# EAGLE schematic CN-Cape006-via08-fixed (EAGLE 7.2.0)

## Sheet 1 of 7: Spannungsversorgung Verpolungsschutz ? Größe der Sicherung ? 1A oder 3A für Servos?
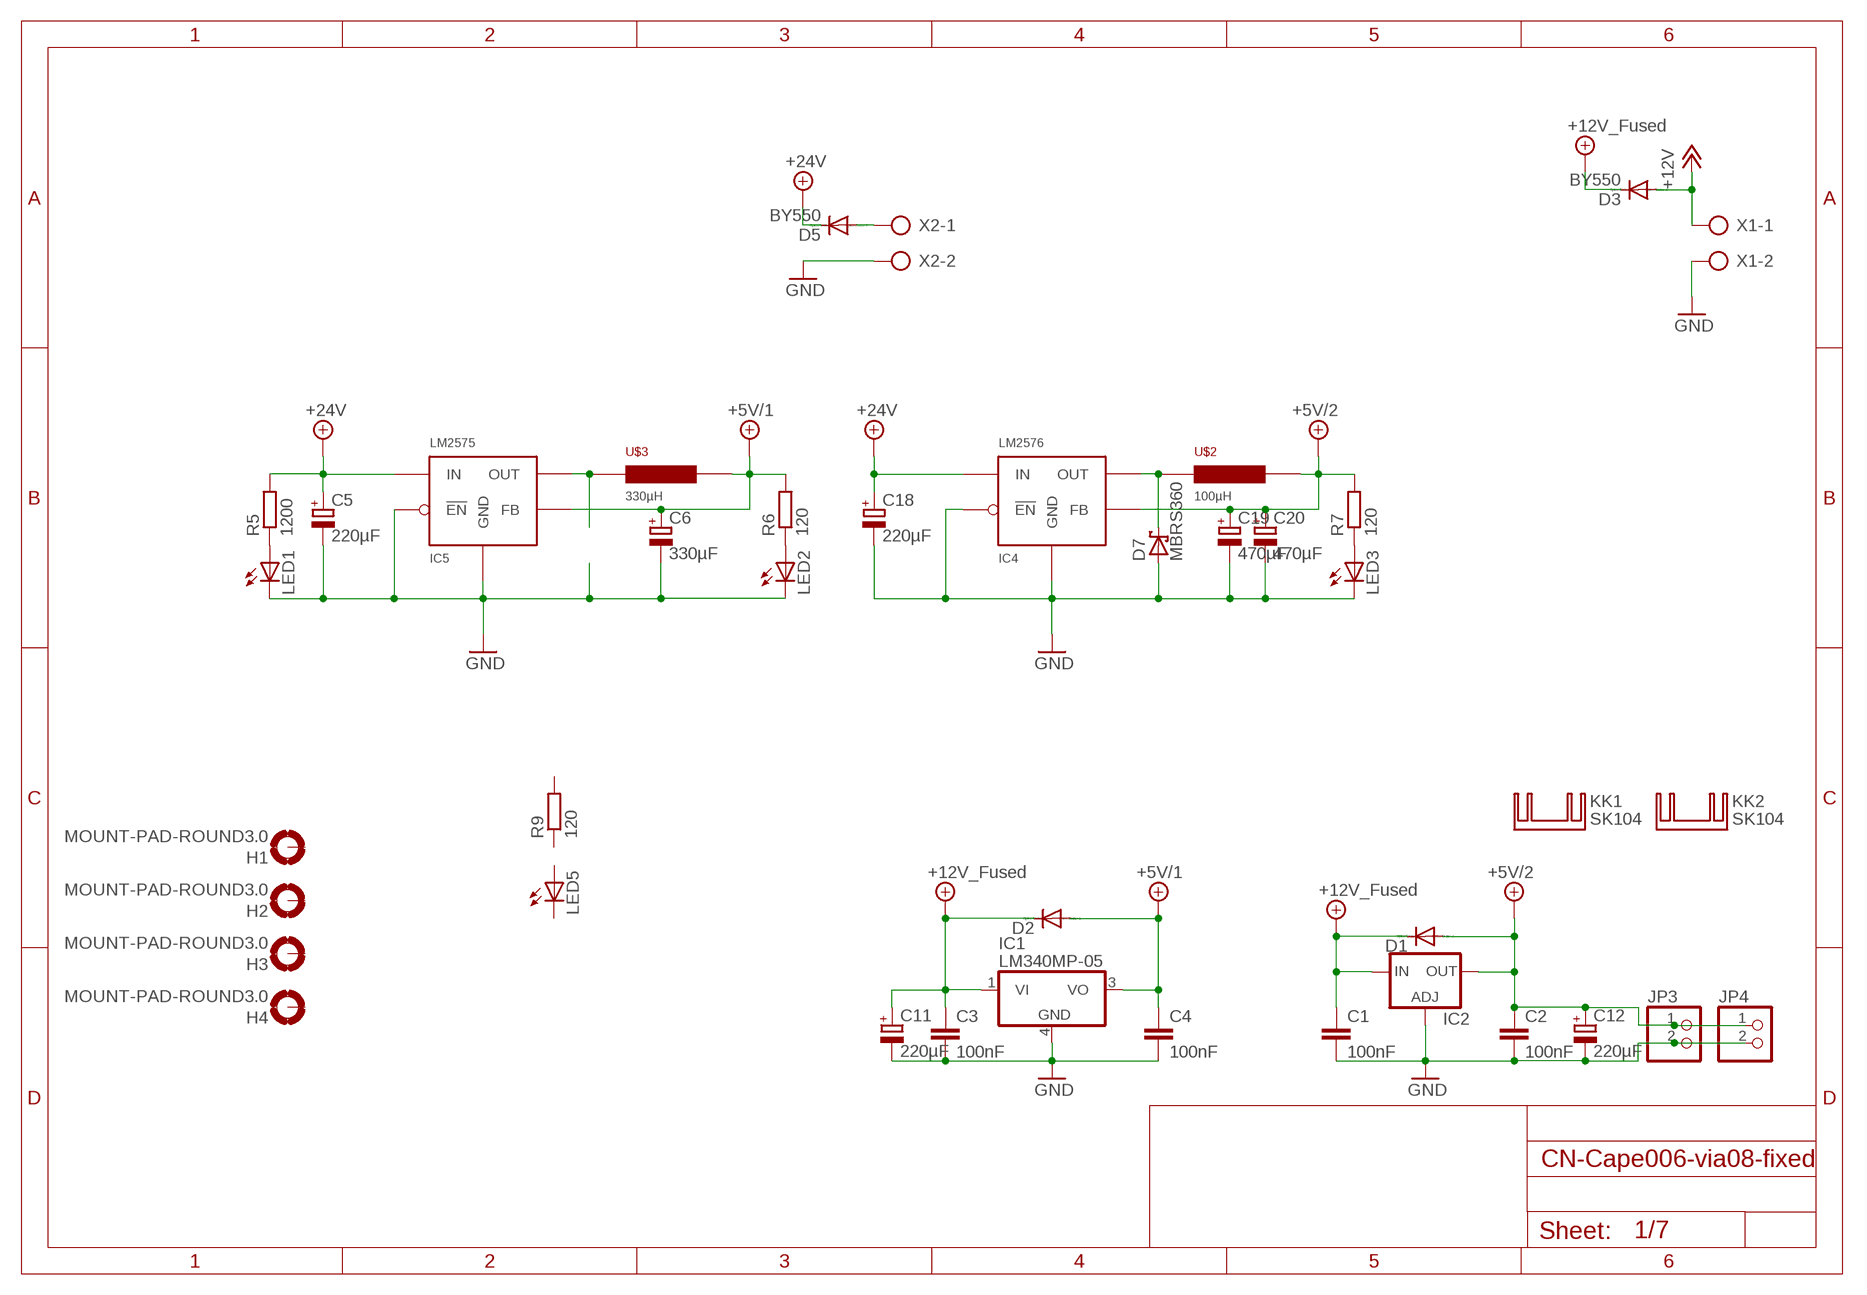
[diagram p0: schematic, sheet 1]

### Parts
C1  100nF  C-EUC0603  [C0603]
C2  100nF  C-EUC0603  [C0603]
C3  100nF  C-EUC0603  [C0603]
C4  100nF  C-EUC0603  [C0603]
C5  220µF  CPOL-EUE3.5-8  [E3,5-8]
C6  330µF  CPOL-EUE5-10.5  [E5-10,5]
C11  220µF  CPOL-EUE3.5-8  [E3,5-8]
C12  220µF  CPOL-EUE3.5-8  [E3,5-8]
C18  220µF  CPOL-EUE3.5-8  [E3,5-8]
C19  470µF  CPOL-EUE3.5-8  [E3,5-8]
C20  470µF  CPOL-EUE3.5-8  [E3,5-8]
D1  DIODE-SOD123  [SOD123]
D2  DIODE-SOD123  [SOD123]
D3  BY550  [DO27-15]
D5  BY550  [DO27-15]
D7  MBRS360  MBRS340T3  [SMC]
H1  MOUNT-PAD-ROUND3.0  [3,0-PAD]
H2  MOUNT-PAD-ROUND3.0  [3,0-PAD]
H3  MOUNT-PAD-ROUND3.0  [3,0-PAD]
H4  MOUNT-PAD-ROUND3.0  [3,0-PAD]
IC1  LM340MP-05  [SOT223]
IC2  LM138-TL  [TO220L1]
IC4  LM2576  LM2576-T05A  [TO-220-5_IN-LINE]
IC5  LM2575  LM2576-T05A  [TO-220-5_IN-LINE]
JP3  PINHD-1X2  [1X02]
JP4  PINHD-1X2  [1X02]
KK1  SK104  [SK104]
KK2  SK104  [SK104]
LED1  LEDCHIP-LED0603  [CHIP-LED0603]
LED2  LEDCHIP-LED0603  [CHIP-LED0603]
LED3  LEDCHIP-LED0603  [CHIP-LED0603]
LED5  LEDCHIP-LED0603  [CHIP-LED0603]
R5  1200  R-EU_R0805  [R0805]
R6  120  R-EU_R0805  [R0805]
R7  120  R-EU_R0805  [R0805]
R9  120  R-EU_R0805  [R0805]
U$2  100µH  PISR  [PISR]
U$3  330µH  PISR  [PISR]
X1  AK500/2-H  [AK500/2-H]
X2  AK500/2-H  [AK500/2-H]

### Nets
+5V/1: C4.1 C6.+ D2.A IC1.3(VO) IC5.FB R6.2 U$3.P$2 ; also sheet 2,3,4,5
+5V/2: C2.1 C12.+ C19.+ C20.+ D1.A IC2.2(OUT) IC4.FB JP3.1 JP4.1 R7.2 U$2.P$2 ; also sheet 5
+10V: C1.1 C3.1 C11.+ D1.C D2.C D3.C IC1.1(VI) IC2.3(IN) ; supply symbol labelled +12V_Fused
+12V: D3.A X1.1
+24V: C5.+ C18.+ D5.C IC4.IN IC5.IN R5.2
GND: C1.2 C2.2 C3.2 C4.2 C5.- C6.- C11.- C12.- C18.- C19.- C20.- D7.A IC1.4(GND) IC2.1(ADJ) IC4.!EN IC4.GND IC5.!EN IC5.GND JP3.2 JP4.2 LED1.C LED2.C LED3.C X1.2 X2.2 ; also sheet 2,3,4,5,6,7
N$5: D5.A X2.1
N$6: LED1.A R5.1
N$7: LED2.A R6.1
N$8: LED3.A R7.1
N$11: IC5.OUT U$3.P$1
N$12: D7.C IC4.OUT U$2.P$1
Unconnected: H1.B3,0(MOUNT) H2.B3,0(MOUNT) H3.B3,0(MOUNT) H4.B3,0(MOUNT) LED5.A LED5.C R9.1 R9.2

## Sheet 2 of 7: BeagleBoard Black Expansion Header
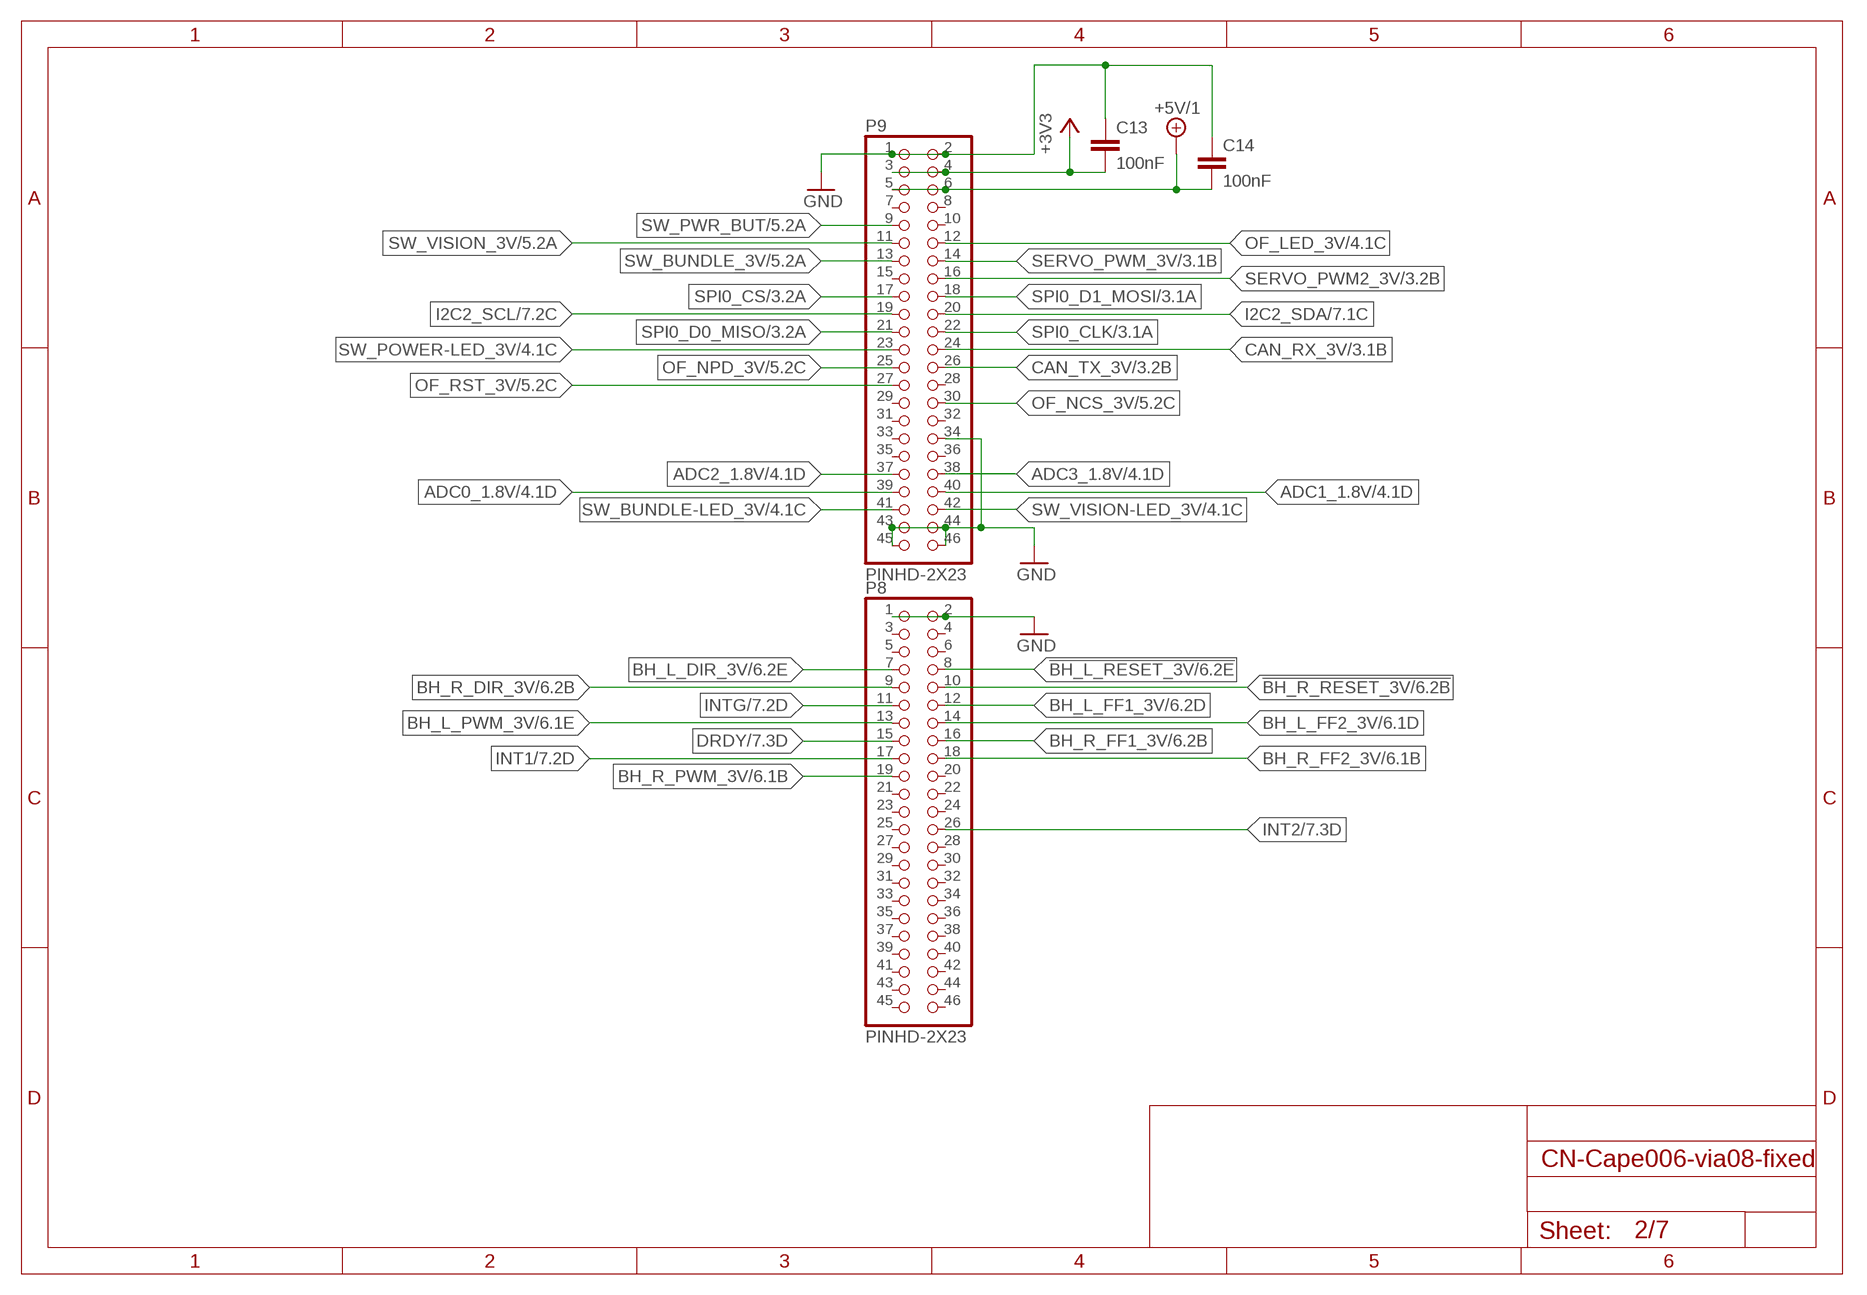
[diagram p1: schematic, sheet 2]

### Parts
C13  100nF  C-EUC0603  [C0603]
C14  100nF  C-EUC0603  [C0603]
P8  PINHD-2X23  [2X23]
P9  PINHD-2X23  [2X23]

### Nets
!BH_L_RESET_3V: P8.8 ; also sheet 6
!BH_R_RESET_3V: P8.10 ; also sheet 6
+3V3: C13.2 P9.3 P9.4 ; also sheet 3,6,7
+5V/1: C14.2 P9.5 P9.6 ; also sheet 1,3,4,5
ADC0_1.8V: P9.39 ; also sheet 4
ADC1_1.8V: P9.40 ; also sheet 4
ADC2_1.8V: P9.37 ; also sheet 4
ADC3_1.8V: P9.38 ; also sheet 4
BH_L_DIR_3V: P8.7 ; also sheet 6
BH_L_FF1_3V: P8.12 ; also sheet 6
BH_L_FF2_3V: P8.14 ; also sheet 6
BH_L_PWM_3V: P8.13 ; also sheet 6
BH_R_DIR_3V: P8.9 ; also sheet 6
BH_R_FF1_3V: P8.16 ; also sheet 6
BH_R_FF2_3V: P8.18 ; also sheet 6
BH_R_PWM_3V: P8.19 ; also sheet 6
CAN_RX_3V: P9.24 ; also sheet 3
CAN_TX_3V: P9.26 ; also sheet 3
DRDY: P8.15 ; also sheet 7
GND: C13.1 C14.1 P8.1 P8.2 P9.1 P9.2 P9.34 P9.43 P9.44 P9.45 P9.46 ; also sheet 1,3,4,5,6,7
I2C2_SCL: P9.19 ; also sheet 7
I2C2_SDA: P9.20 ; also sheet 7
INT1: P8.17 ; also sheet 7
INT2: P8.26 ; also sheet 7
INTG: P8.11 ; also sheet 7
OF_LED_3V: P9.12 ; also sheet 4
OF_NCS_3V: P9.30 ; also sheet 5
OF_NPD_3V: P9.25 ; also sheet 5
OF_RST_3V: P9.27 ; also sheet 5
SERVO_PWM2_3V: P9.16 ; also sheet 3
SERVO_PWM_3V: P9.14 ; also sheet 3
SPI0_CLK: P9.22 ; also sheet 3,5
SPI0_CS: P9.17 ; also sheet 3
SPI0_D0_MISO: P9.21 ; also sheet 3,5
SPI0_D1_MOSI: P9.18 ; also sheet 3,5
SW_BUNDLE-LED_3V: P9.41 ; also sheet 4
SW_BUNDLE_3V: P9.13 ; also sheet 5
SW_POWER-LED_3V: P9.23 ; also sheet 4
SW_PWR_BUT: P9.9 ; also sheet 5
SW_VISION-LED_3V: P9.42 ; also sheet 4
SW_VISION_3V: P9.11 ; also sheet 5
Unconnected: P8.3 P8.4 P8.5 P8.6 P8.20 P8.21 P8.22 P8.23 P8.24 P8.25 P8.27 P8.28 P8.29 P8.30 P8.31 P8.32 P8.33 P8.34 P8.35 P8.36 P8.37 P8.38 P8.39 P8.40 P8.41 P8.42 P8.43 P8.44 P8.45 P8.46 P9.7 P9.8 P9.10 P9.15 P9.28 P9.29 P9.31 P9.32 P9.33 P9.35 P9.36

## Sheet 3 of 7: Level Shifter
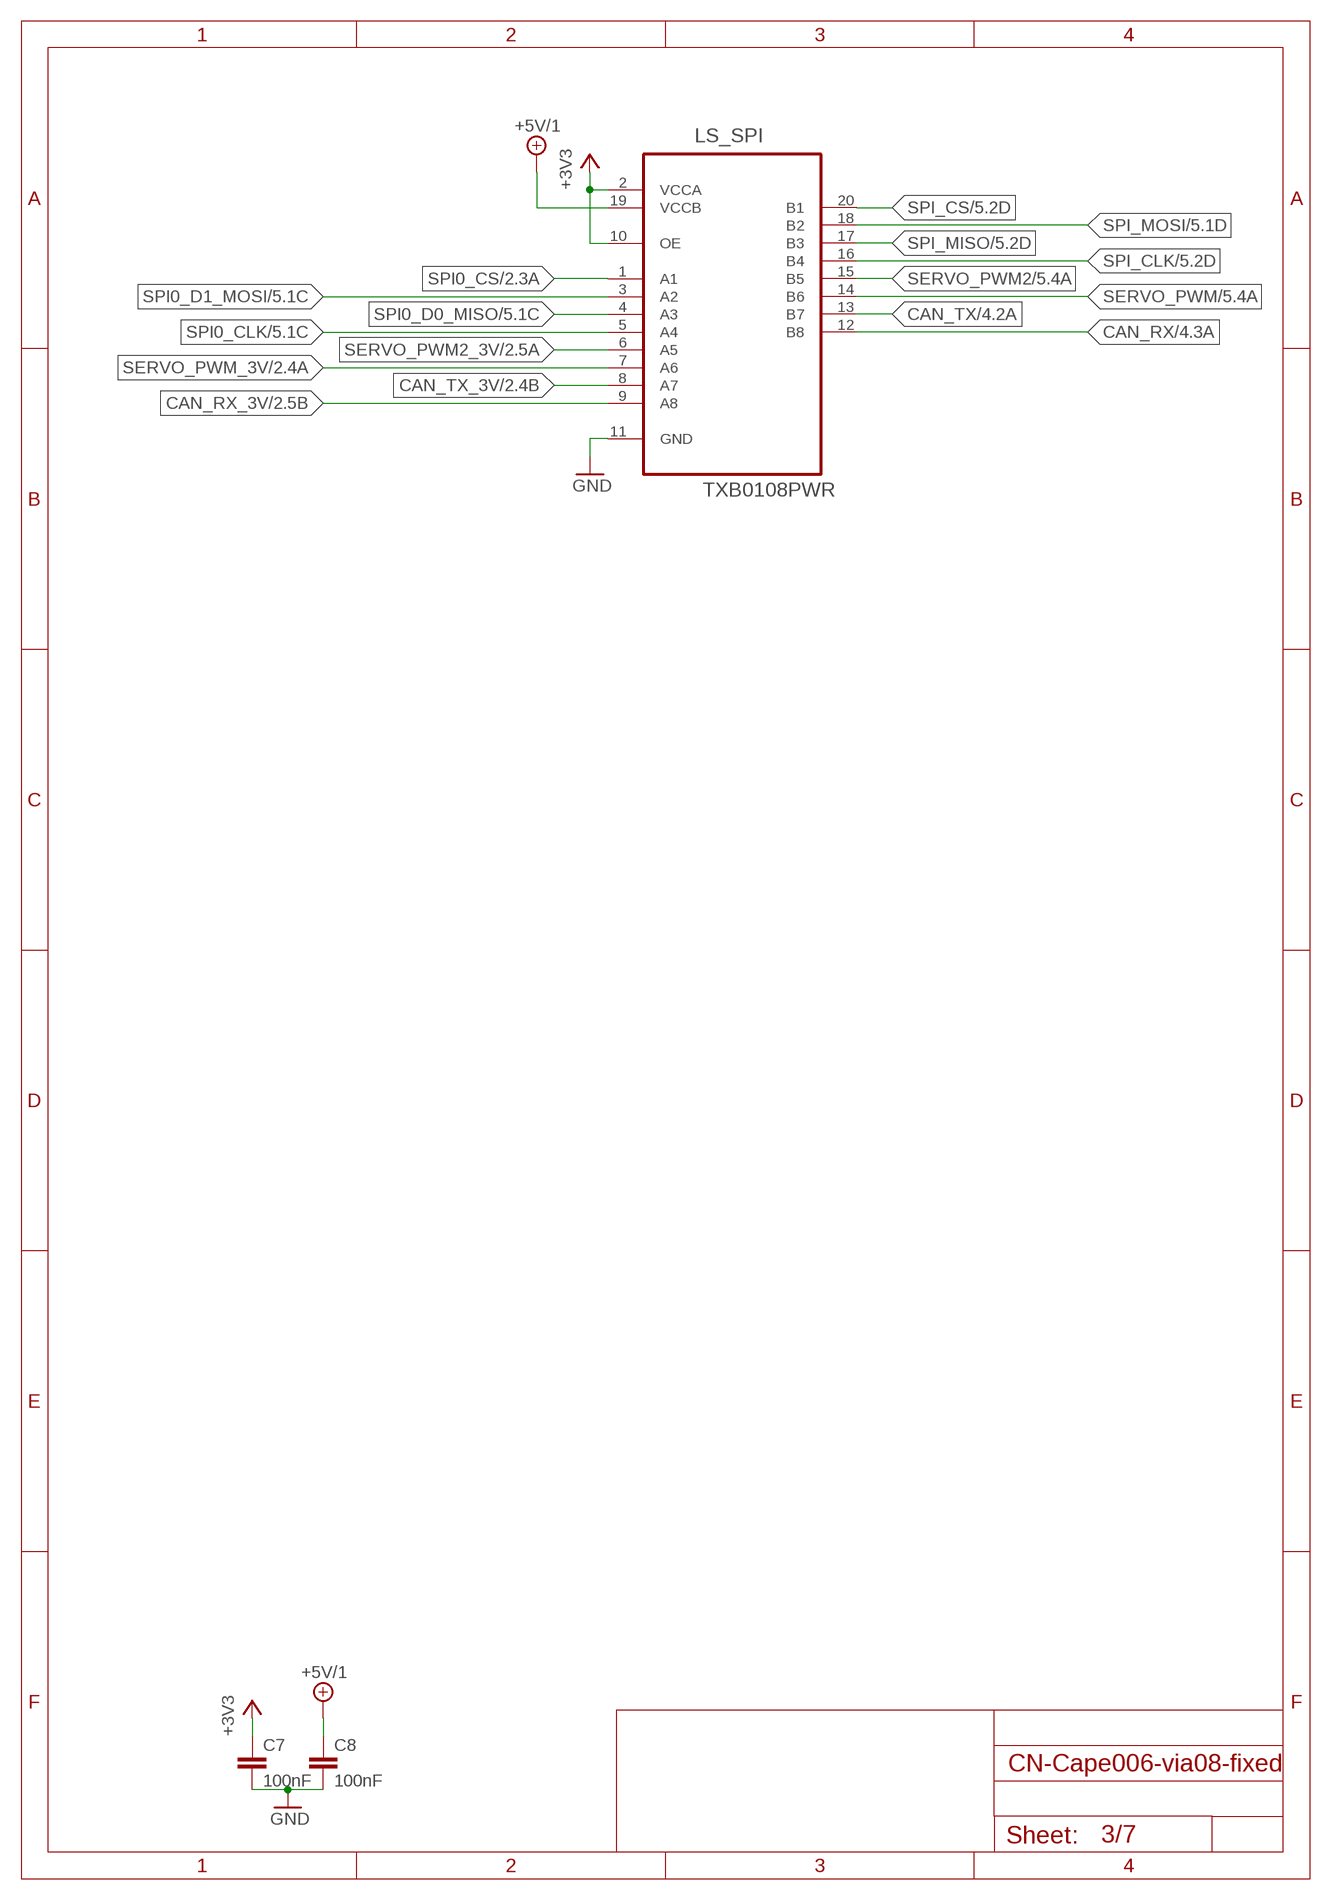
[diagram p2: schematic, sheet 3]

### Parts
C7  100nF  C-EUC0603  [C0603]
C8  100nF  C-EUC0603  [C0603]
LS_SPI  TXB0108PWR  [SOP65P640X120-20N]

### Nets
+3V3: C7.1 LS_SPI.2(VCCA) LS_SPI.10(OE) ; also sheet 2,6,7
+5V/1: C8.1 LS_SPI.19(VCCB) ; also sheet 1,2,4,5
CAN_RX: LS_SPI.12(B8) ; also sheet 4
CAN_RX_3V: LS_SPI.9(A8) ; also sheet 2
CAN_TX: LS_SPI.13(B7) ; also sheet 4
CAN_TX_3V: LS_SPI.8(A7) ; also sheet 2
GND: C7.2 C8.2 LS_SPI.11(GND) ; also sheet 1,2,4,5,6,7
SERVO_PWM: LS_SPI.14(B6) ; also sheet 5
SERVO_PWM2: LS_SPI.15(B5) ; also sheet 5
SERVO_PWM2_3V: LS_SPI.6(A5) ; also sheet 2
SERVO_PWM_3V: LS_SPI.7(A6) ; also sheet 2
SPI0_CLK: LS_SPI.5(A4) ; also sheet 2,5
SPI0_CS: LS_SPI.1(A1) ; also sheet 2
SPI0_D0_MISO: LS_SPI.4(A3) ; also sheet 2,5
SPI0_D1_MOSI: LS_SPI.3(A2) ; also sheet 2,5
SPI_CLK: LS_SPI.16(B4) ; also sheet 5
SPI_CS: LS_SPI.20(B1) ; also sheet 5
SPI_MISO: LS_SPI.17(B3) ; also sheet 5
SPI_MOSI: LS_SPI.18(B2) ; also sheet 5

## Sheet 4 of 7: CAN- Bus & LED Transistoren
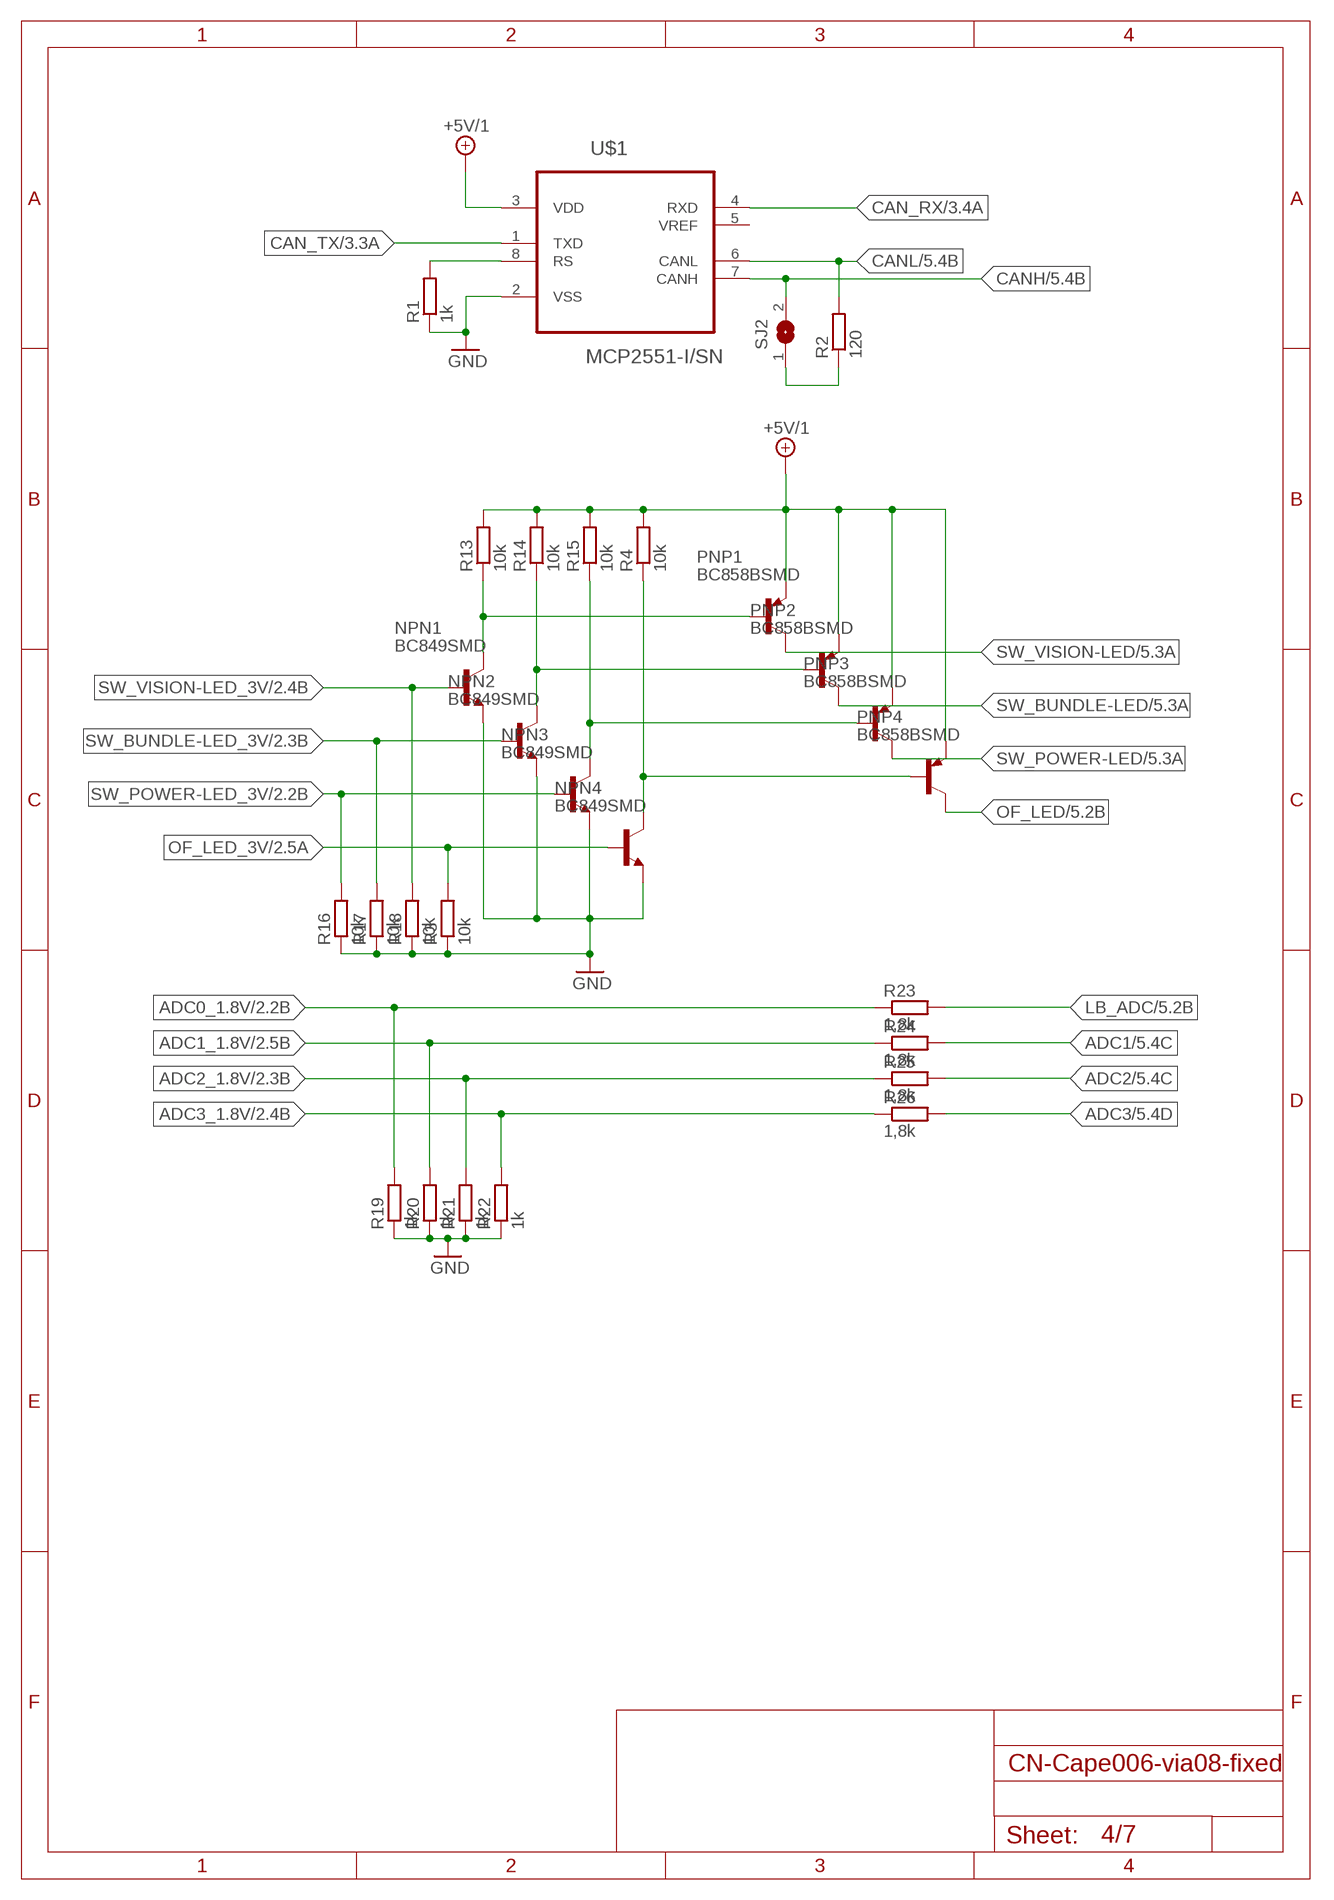
[diagram p3: schematic, sheet 4]

### Parts
NPN1  BC849SMD  [SOT23-BEC]
NPN2  BC849SMD  [SOT23-BEC]
NPN3  BC849SMD  [SOT23-BEC]
NPN4  BC849SMD  [SOT23-BEC]
PNP1  BC858BSMD  [SOT23-BEC]
PNP2  BC858BSMD  [SOT23-BEC]
PNP3  BC858BSMD  [SOT23-BEC]
PNP4  BC858BSMD  [SOT23-BEC]
R1  1k  R-EU_R0805  [R0805]
R2  120  R-EU_R0805  [R0805]
R3  10k  R-EU_R0805  [R0805]
R4  10k  R-EU_R0805  [R0805]
R13  10k  R-EU_R0805  [R0805]
R14  10k  R-EU_R0805  [R0805]
R15  10k  R-EU_R0805  [R0805]
R16  10k  R-EU_R0805  [R0805]
R17  10k  R-EU_R0805  [R0805]
R18  10k  R-EU_R0805  [R0805]
R19  1k  R-EU_R0805  [R0805]
R20  1k  R-EU_R0805  [R0805]
R21  1k  R-EU_R0805  [R0805]
R22  1k  R-EU_R0805  [R0805]
R23  1,8k  R-EU_R0805  [R0805]
R24  1,8k  R-EU_R0805  [R0805]
R25  1,8k  R-EU_R0805  [R0805]
R26  1,8k  R-EU_R0805  [R0805]
SJ2  SJ  [SJ]
U$1  MCP2551-I/SN  [SOIC127P600X175-8N]

### Nets
+5V/1: PNP1.E PNP2.E PNP3.E PNP4.E R4.2 R13.2 R14.2 R15.2 U$1.3(VDD) ; also sheet 1,2,3,5
ADC0_1.8V: R19.2 R23.1 ; also sheet 2
ADC1: R24.2 ; also sheet 5
ADC1_1.8V: R20.2 R24.1 ; also sheet 2
ADC2: R25.2 ; also sheet 5
ADC2_1.8V: R21.2 R25.1 ; also sheet 2
ADC3: R26.2 ; also sheet 5
ADC3_1.8V: R22.2 R26.1 ; also sheet 2
CAN_RX: U$1.4(RXD) ; also sheet 3
CAN_TX: U$1.1(TXD) ; also sheet 3
CANH: SJ2.2 U$1.7(CANH) ; also sheet 5
CANL: R2.2 U$1.6(CANL) ; also sheet 5
GND: NPN1.E NPN2.E NPN3.E NPN4.E R1.1 R3.1 R16.1 R17.1 R18.1 R19.1 R20.1 R21.1 R22.1 U$1.2(VSS) ; also sheet 1,2,3,5,6,7
LB_ADC: R23.2 ; also sheet 5
N$1: NPN1.C PNP1.B R13.1
N$2: NPN2.C PNP2.B R14.1
N$3: NPN4.C PNP4.B R4.1
N$4: NPN3.C PNP3.B R15.1
N$9: R1.2 U$1.8(RS)
N$10: R2.1 SJ2.1
OF_LED: PNP4.C ; also sheet 5
OF_LED_3V: NPN4.B R3.2 ; also sheet 2
SW_BUNDLE-LED: PNP2.C ; also sheet 5
SW_BUNDLE-LED_3V: NPN2.B R17.2 ; also sheet 2
SW_POWER-LED: PNP3.C ; also sheet 5
SW_POWER-LED_3V: NPN3.B R16.2 ; also sheet 2
SW_VISION-LED: PNP1.C ; also sheet 5
SW_VISION-LED_3V: NPN1.B R18.2 ; also sheet 2
Unconnected: U$1.5(VREF)

## Sheet 5 of 7: Connector
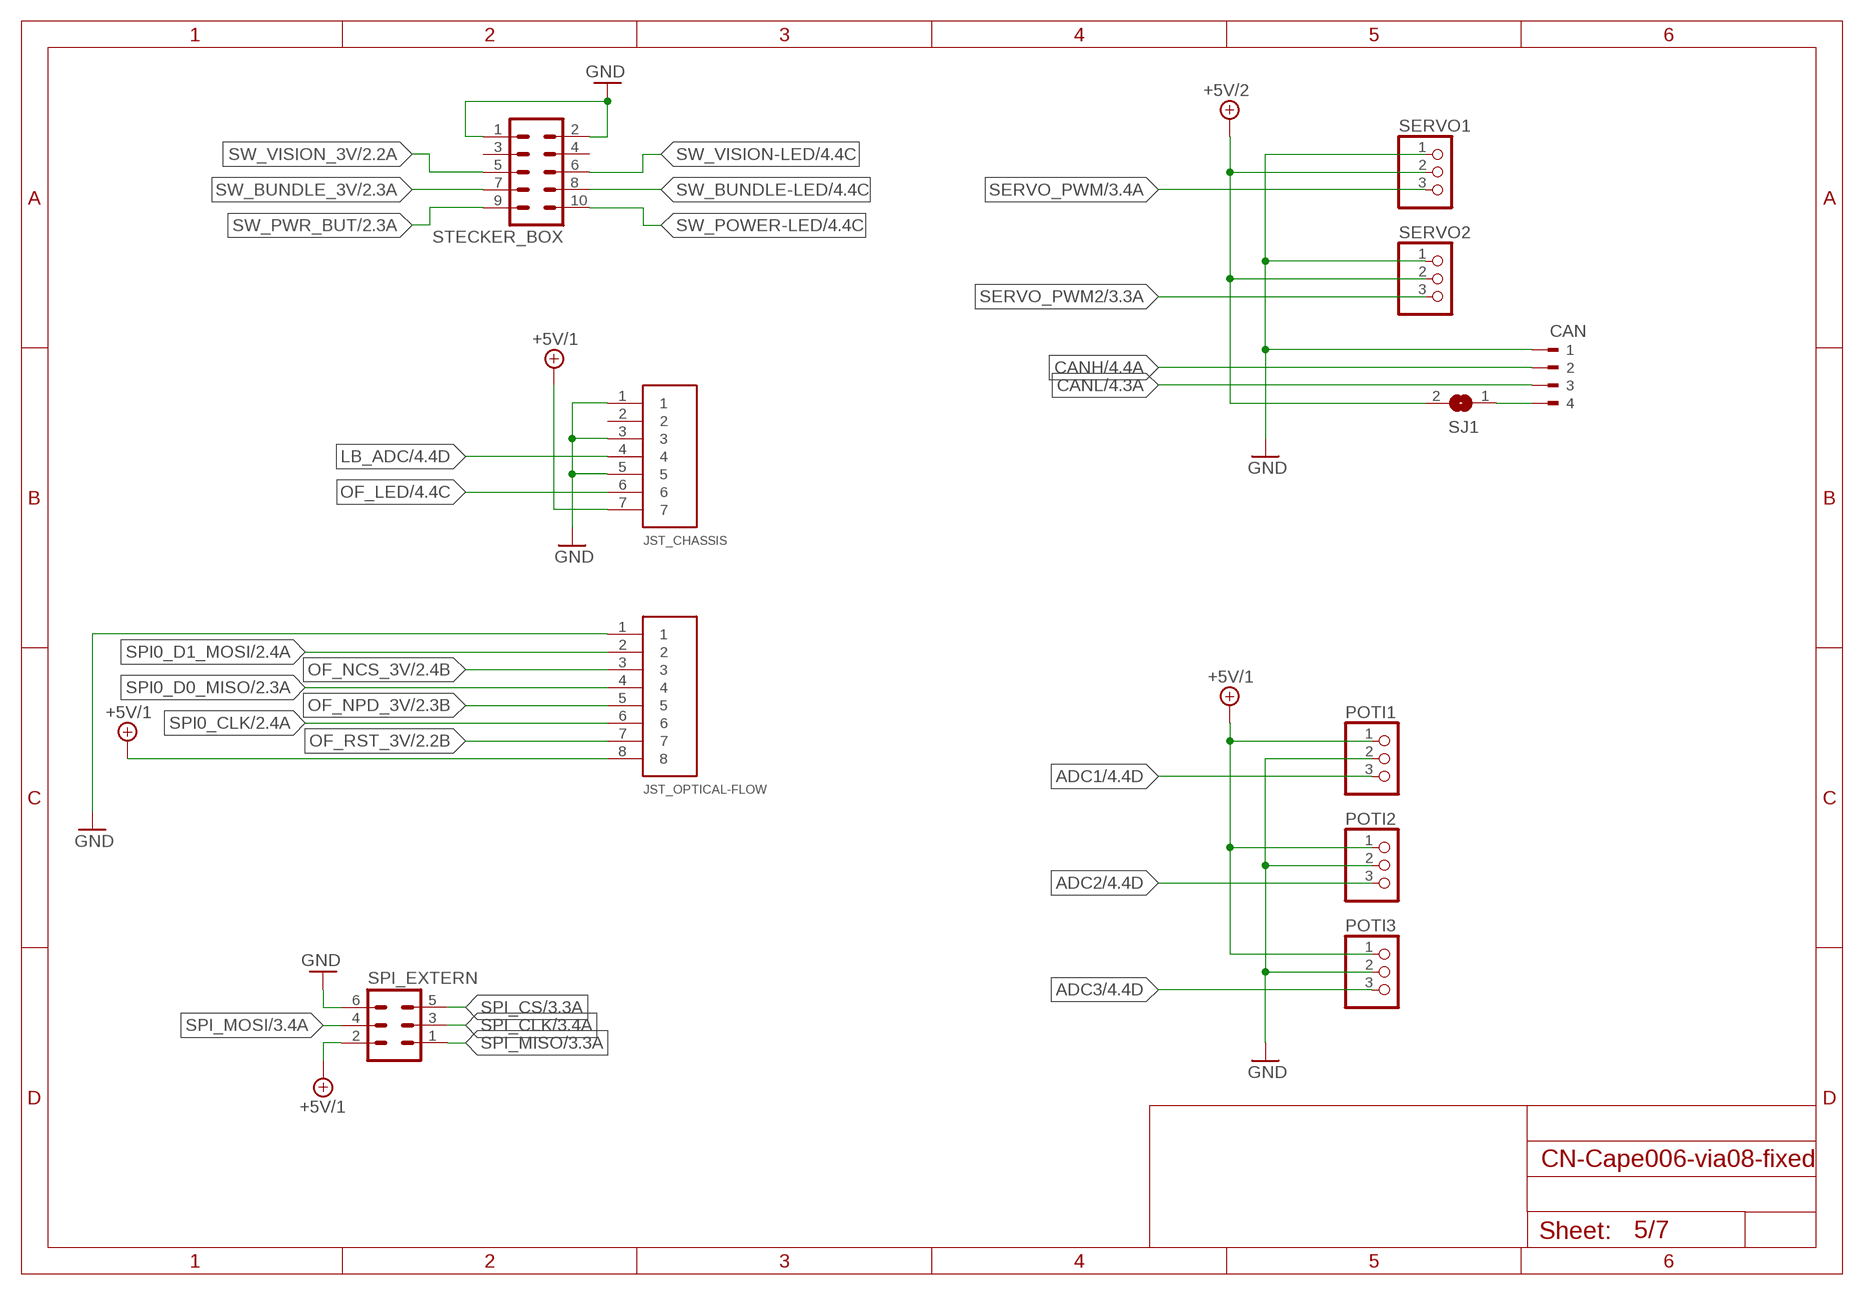
[diagram p4: schematic, sheet 5]

### Parts
CAN  90-4  [90-4]
JST_CHASSIS  S7PIN  [S7B-EH]
JST_OPTICAL-FLOW  S8PIN  [S8B-EH]
POTI1  PINHD-1X3  [1X03]
POTI2  PINHD-1X3  [1X03]
POTI3  PINHD-1X3  [1X03]
SERVO1  PINHD-1X3  [1X03]
SERVO2  PINHD-1X3  [1X03]
SJ1  SJ  [SJ]
SPI_EXTERN  ML6  [ML6]
STECKER_BOX  ML10  [ML10]

### Nets
5V/2_F&J: CAN.4 SJ1.1
+5V/1: JST_CHASSIS.7 JST_OPTICAL-FLOW.8 POTI1.1 POTI2.1 POTI3.1 SPI_EXTERN.2 ; also sheet 1,2,3,4
+5V/2: SERVO1.2 SERVO2.2 SJ1.2 ; also sheet 1
ADC1: POTI1.3 ; also sheet 4
ADC2: POTI2.3 ; also sheet 4
ADC3: POTI3.3 ; also sheet 4
CANH: CAN.2 ; also sheet 4
CANL: CAN.3 ; also sheet 4
GND: CAN.1 JST_CHASSIS.1 JST_CHASSIS.3 JST_CHASSIS.5 JST_OPTICAL-FLOW.1 POTI1.2 POTI2.2 POTI3.2 SERVO1.1 SERVO2.1 SPI_EXTERN.6 STECKER_BOX.1 STECKER_BOX.2 ; also sheet 1,2,3,4,6,7
LB_ADC: JST_CHASSIS.4 ; also sheet 4
OF_LED: JST_CHASSIS.6 ; also sheet 4
OF_NCS_3V: JST_OPTICAL-FLOW.3 ; also sheet 2
OF_NPD_3V: JST_OPTICAL-FLOW.5 ; also sheet 2
OF_RST_3V: JST_OPTICAL-FLOW.7 ; also sheet 2
SERVO_PWM: SERVO1.3 ; also sheet 3
SERVO_PWM2: SERVO2.3 ; also sheet 3
SPI0_CLK: JST_OPTICAL-FLOW.6 ; also sheet 2,3
SPI0_D0_MISO: JST_OPTICAL-FLOW.4 ; also sheet 2,3
SPI0_D1_MOSI: JST_OPTICAL-FLOW.2 ; also sheet 2,3
SPI_CLK: SPI_EXTERN.3 ; also sheet 3
SPI_CS: SPI_EXTERN.5 ; also sheet 3
SPI_MISO: SPI_EXTERN.1 ; also sheet 3
SPI_MOSI: SPI_EXTERN.4 ; also sheet 3
SW_BUNDLE-LED: STECKER_BOX.8 ; also sheet 4
SW_BUNDLE_3V: STECKER_BOX.7 ; also sheet 2
SW_POWER-LED: STECKER_BOX.10 ; also sheet 4
SW_PWR_BUT: STECKER_BOX.9 ; also sheet 2
SW_VISION-LED: STECKER_BOX.6 ; also sheet 4
SW_VISION_3V: STECKER_BOX.5 ; also sheet 2
Unconnected: JST_CHASSIS.2 STECKER_BOX.3 STECKER_BOX.4

## Sheet 6 of 7: BallHandle
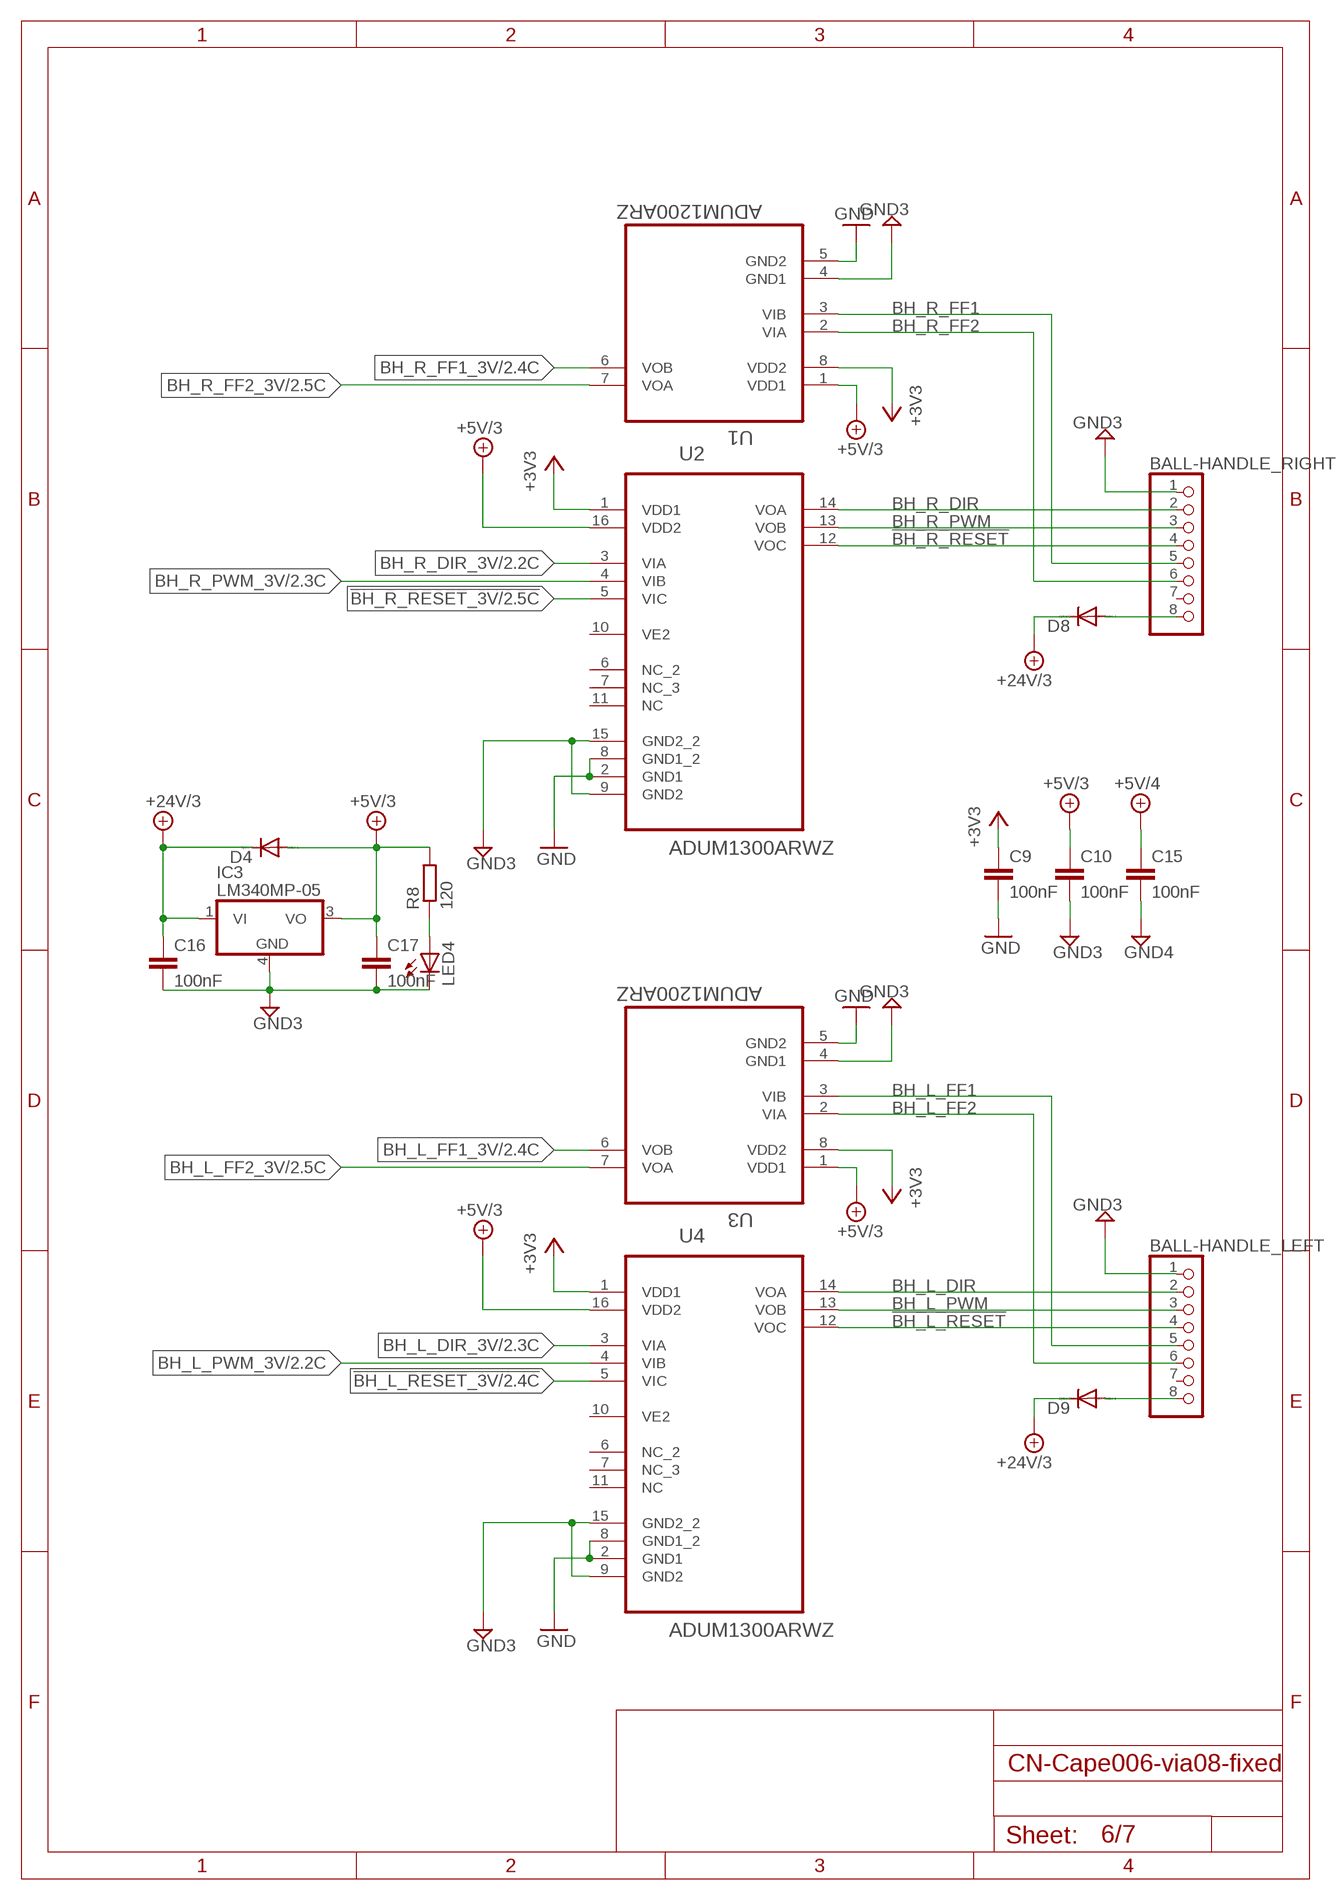
[diagram p5: schematic, sheet 6]

### Parts
BALL-HANDLE_LEFT  PINHD-1X8  [1X08]
BALL-HANDLE_RIGHT  PINHD-1X8  [1X08]
C9  100nF  C-EUC0603  [C0603]
C10  100nF  C-EUC0603  [C0603]
C15  100nF  C-EUC0603  [C0603]
C16  100nF  C-EUC0603  [C0603]
C17  100nF  C-EUC0603  [C0603]
D4  DIODE-SOD123  [SOD123]
D8  DIODE-SOD123  [SOD123]
D9  DIODE-SOD123  [SOD123]
IC3  LM340MP-05  [SOT223]
LED4  LEDCHIP-LED0603  [CHIP-LED0603]
R8  120  R-EU_R0805  [R0805]
U1  ADUM1200ARZ  [SOIC127P600X175-8N]
U2  ADUM1300ARWZ  [SOIC127P1032X265-16N]
U3  ADUM1200ARZ  [SOIC127P600X175-8N]
U4  ADUM1300ARWZ  [SOIC127P1032X265-16N]

### Nets
!BH_L_RESET: BALL-HANDLE_LEFT.4 U4.12(VOC)
!BH_L_RESET_3V: U4.5(VIC) ; also sheet 2
!BH_R_RESET: BALL-HANDLE_RIGHT.4 U2.12(VOC)
!BH_R_RESET_3V: U2.5(VIC) ; also sheet 2
+3V3: C9.1 U1.8(VDD2) U2.1(VDD1) U3.8(VDD2) U4.1(VDD1) ; also sheet 2,3,7
+5V/3: C10.1 C17.1 D4.A IC3.3(VO) R8.2 U1.1(VDD1) U2.16(VDD2) U3.1(VDD1) U4.16(VDD2)
+5V/4: C15.1
+24V/3: C16.1 D4.C D8.C D9.C IC3.1(VI)
BH_L_DIR: BALL-HANDLE_LEFT.2 U4.14(VOA)
BH_L_DIR_3V: U4.3(VIA) ; also sheet 2
BH_L_FF1: BALL-HANDLE_LEFT.5 U3.3(VIB)
BH_L_FF1_3V: U3.6(VOB) ; also sheet 2
BH_L_FF2: BALL-HANDLE_LEFT.6 U3.2(VIA)
BH_L_FF2_3V: U3.7(VOA) ; also sheet 2
BH_L_PWM: BALL-HANDLE_LEFT.3 U4.13(VOB)
BH_L_PWM_3V: U4.4(VIB) ; also sheet 2
BH_R_DIR: BALL-HANDLE_RIGHT.2 U2.14(VOA)
BH_R_DIR_3V: U2.3(VIA) ; also sheet 2
BH_R_FF1: BALL-HANDLE_RIGHT.5 U1.3(VIB)
BH_R_FF1_3V: U1.6(VOB) ; also sheet 2
BH_R_FF2: BALL-HANDLE_RIGHT.6 U1.2(VIA)
BH_R_FF2_3V: U1.7(VOA) ; also sheet 2
BH_R_PWM: BALL-HANDLE_RIGHT.3 U2.13(VOB)
BH_R_PWM_3V: U2.4(VIB) ; also sheet 2
GND: C9.2 U1.5(GND2) U2.2(GND1) U2.8(GND1_2) U3.5(GND2) U4.2(GND1) U4.8(GND1_2) ; also sheet 1,2,3,4,5,7
GND3: BALL-HANDLE_LEFT.1 BALL-HANDLE_RIGHT.1 C10.2 C16.2 C17.2 IC3.4(GND) LED4.C U1.4(GND1) U2.9(GND2) U2.15(GND2_2) U3.4(GND1) U4.9(GND2) U4.15(GND2_2)
GND4: C15.2
N$13: BALL-HANDLE_LEFT.8 D9.A
N$14: BALL-HANDLE_RIGHT.8 D8.A
N$15: LED4.A R8.1
Unconnected: BALL-HANDLE_LEFT.7 BALL-HANDLE_RIGHT.7 U2.6(NC_2) U2.7(NC_3) U2.10(VE2) U2.11(NC) U4.6(NC_2) U4.7(NC_3) U4.10(VE2) U4.11(NC)

## Sheet 7 of 7
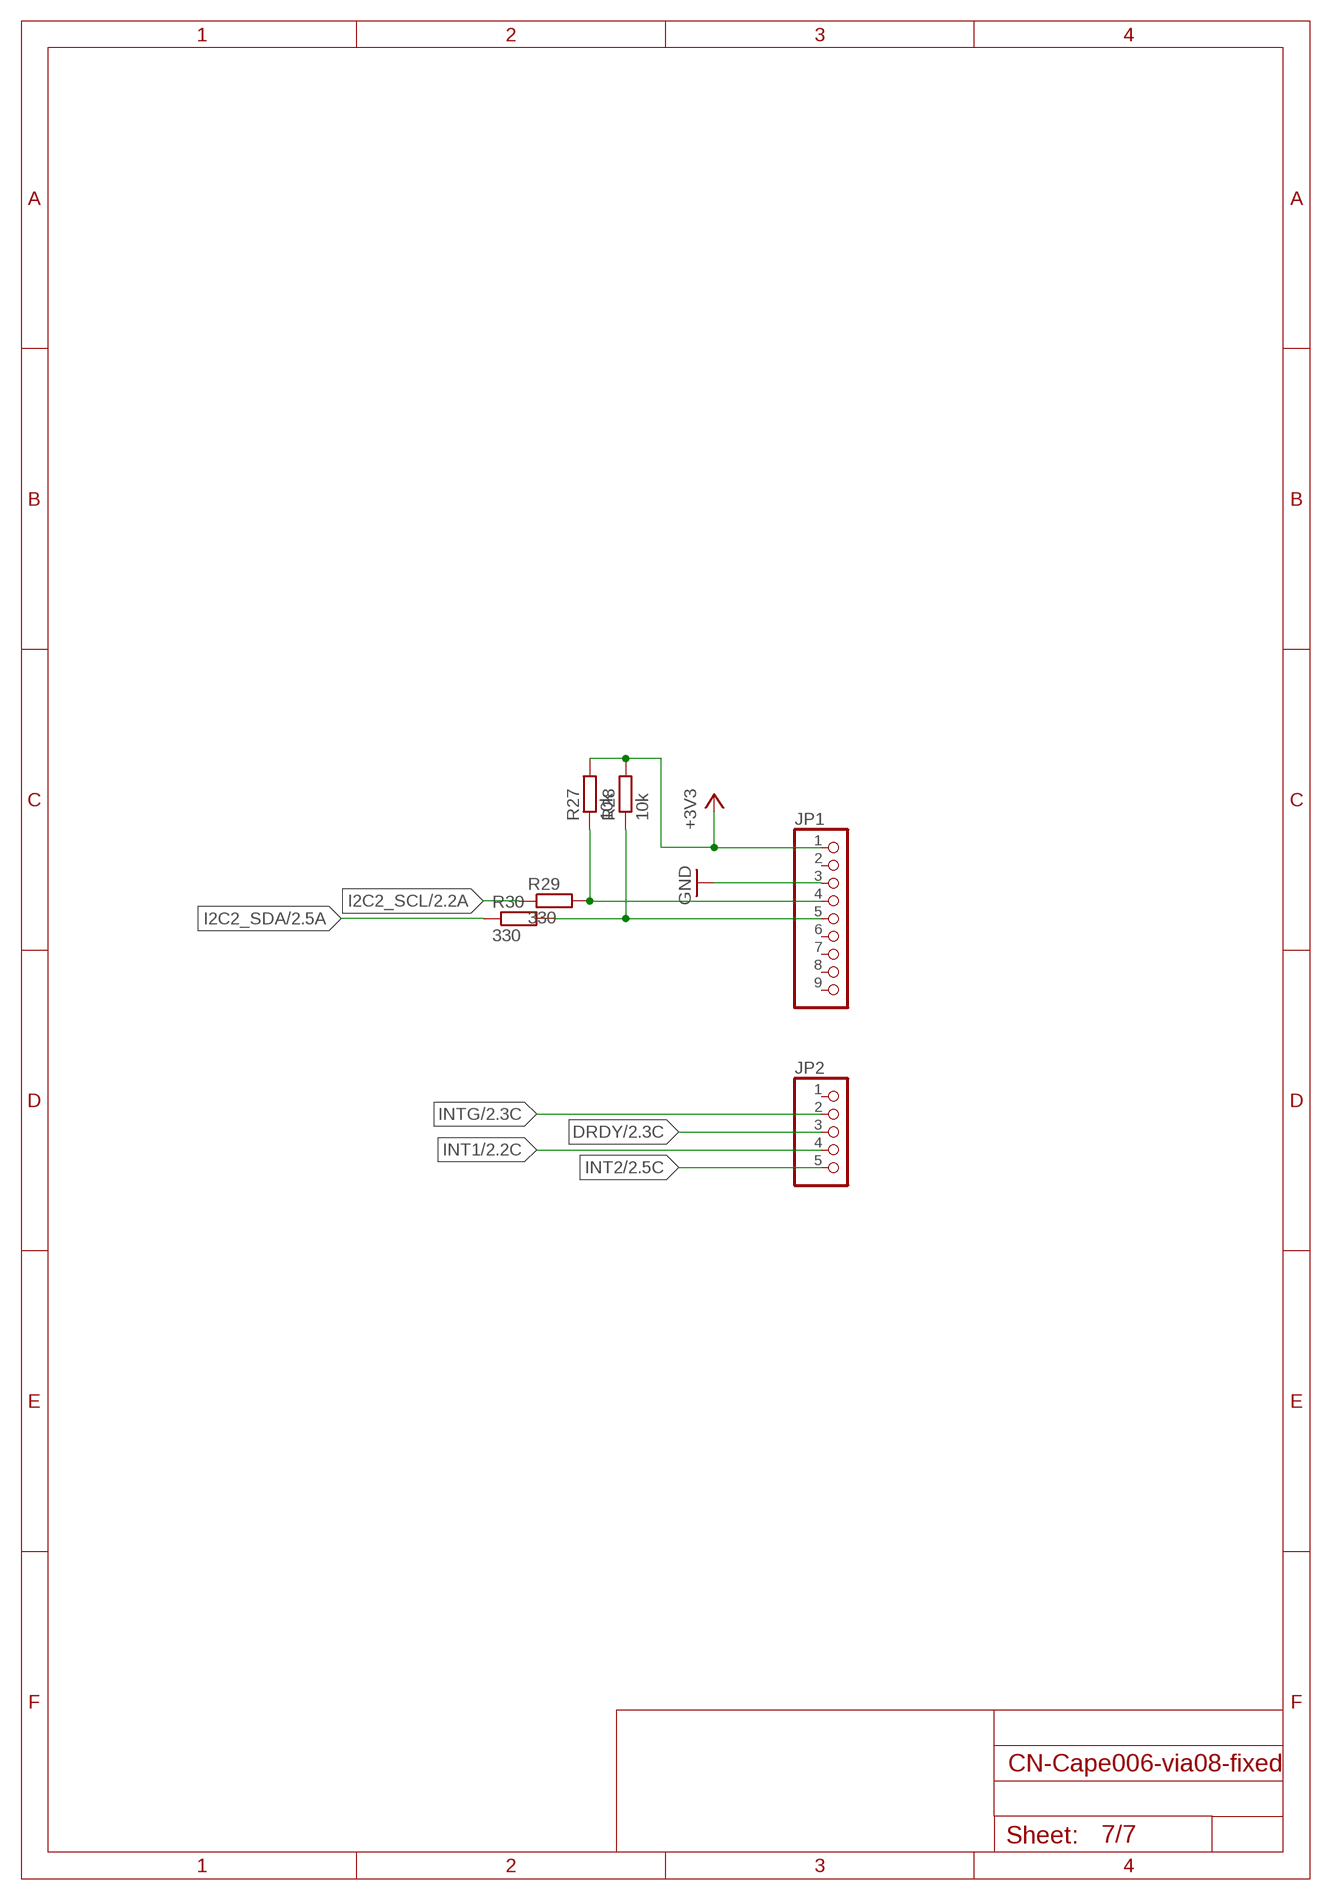
[diagram p6: schematic, sheet 7]

### Parts
JP1  PINHD-1X9  [1X09]
JP2  PINHD-1X5  [1X05]
R27  10k  R-EU_R0805  [R0805]
R28  10k  R-EU_R0805  [R0805]
R29  330  R-EU_R0805  [R0805]
R30  330  R-EU_R0805  [R0805]

### Nets
+3V3: JP1.1 R27.2 R28.2 ; also sheet 2,3,6
DRDY: JP2.3 ; also sheet 2
GND: JP1.3 ; also sheet 1,2,3,4,5,6
I2C2_SCL: R29.1 ; also sheet 2
I2C2_SDA: R30.1 ; also sheet 2
INT1: JP2.4 ; also sheet 2
INT2: JP2.5 ; also sheet 2
INTG: JP2.2 ; also sheet 2
SCL: JP1.4 R27.1 R29.2
SDA: JP1.5 R28.1 R30.2
Unconnected: JP1.2 JP1.6 JP1.7 JP1.8 JP1.9 JP2.1

## Library data of the parts
BALL-HANDLE_LEFT BALL-HANDLE_RIGHT = pinhead:PINHD-1X8: PIN HEADER
C1-C4 C7-C10 C13-C17 = rcl:C-EU: CAPACITOR, European symbol
C5 C6 C11 C12 C18-C20 = rcl:CPOL-EU: POLARIZED CAPACITOR, European symbol
CAN = con-weidmueller-sl35:90-4: WEIDMUELLER CLAMP CONNECTOR
D1 D2 D4 D8 D9 = diode:DIODE-: DIODE; REICHELT: SD 101BW
D3 D5 = diode:BY550: DIODE Si200 V, 5 A
D7 = diode:MBRS3*0T3: SCHOTTKY BARRIER RECTIFIER 3.0 AMPERES 20, 30, 40 VOLT Source: MBRS340T3-D.pdf
H1-H4 = holes:MOUNT-PAD-ROUND: MOUNTING PAD, round
IC1 IC3 = linear:LM340?-*: Positive VOLTAGE REGULATOR Source: http://cache.national.com/ds/LM/LM340.pdf
IC2 = v-reg:LM138-TL: VOLTAGE REGULATOR
IC4 IC5 = to220-custom:LM2576-T05A: LM2576/LM2576HV Series SIMPLE SWITCHER® 3A Step-Down Voltage Regulator IN-LINE PACKAGE
JP1 = pinhead:PINHD-1X9: PIN HEADER
JP2 = pinhead:PINHD-1X5: PIN HEADER
JP3 JP4 = pinhead:PINHD-1X2: PIN HEADER
JST_CHASSIS = jst_eh:S7PIN
JST_OPTICAL-FLOW = jst_eh:S8PIN
KK1 KK2 = heatsink:SK104: HEATSINK manufacturer Fischer/distributor Buerklin
LED1-LED5 = led:LED: LED OSRAM: - CHIPLED LG R971, LG N971, LY N971, LG Q971, LY Q971, LO R971, LY R971 LH N974, LH R974 LS Q976, LO Q976, LY Q976 LO Q996 - Hyper CHIPLED LW Q18S LB Q993, LB Q99A, LB R99A - SideLED LS A670, LO A670, LY A670, LG A670, LP A670 LB A673, LV A673, LT A673, LW A673 LH A674 LY A675 LS A676, LA A676, LO A676, LY A676, LW A676 LS A679, LY A679, LG A679 - Hyper Micro SIDELED® LS Y876, LA Y876, LO Y876, LY Y876 LT Y87S - SmartLED LW L88C, LW L88S LB L89C, LB L89S, LG L890 LS L89K, LO L89K, LY L89K LS L896, LA L896, LO L896, LY L896 - TOPLED LS T670, LO T670, LY T670, LG T670, LP T670 LSG T670, LSP T670, LSY T670, LOP T670, LYG T670 LG T671, LOG T671, LSG T671 LB T673, LV T673, LT T673, LW T673 LH T674 LS T676, LA T676, LO T676, LY T676, LB T676, LH T676, LSB T676, LW T676 LB T67C, LV T67C, LT T67C, LS T67K, LO T67K, LY T67K, LW E67C LS E67B, LA E67B, LO E67B, LY E67B, LB E67C, LV E67C, LT E67C LW T67C LS T679, LY T679, LG T679 LS T770, LO T770, LY T770, LG T770, LP T770 LB T773, LV T773, LT T773, LW T773 LH T774 LS E675, LA E675, LY E675, LS T675 LS T776, LA T776, LO T776, LY T776, LB T776 LHGB T686 LT T68C, LB T68C - Hyper Mini TOPLED® LB M676 - Mini TOPLED Santana® LG M470 LS M47K, LO M47K, LY M47K Source: http://www.osram.convergy.de LUXEON: - LUMILED® LXK2-PW12-R00, LXK2-PW12-S00, LXK2-PW14-U00, LXK2-PW14-V00 LXK2-PM12-R00, LXK2-PM12-S00, LXK2-PM14-U00 LXK2-PE12-Q00, LXK2-PE12-R00, LXK2-PE12-S00, LXK2-PE14-T00, LXK2-PE14-U00 LXK2-PB12-K00, LXK2-PB12-L00, LXK2-PB12-M00, LXK2-PB14-N00, LXK2-PB14-P00, LXK2-PB14-Q00 LXK2-PR12-L00, LXK2-PR12-M00, LXK2-PR14-Q00, LXK2-PR14-R00 LXK2-PD12-Q00, LXK2-PD12-R00, LXK2-PD12-S00 LXK2-PH12-R00, LXK2-PH12-S00 LXK2-PL12-P00, LXK2-PL12-Q00, LXK2-PL12-R00 Source: www.luxeon.com KINGBRIGHT: KA-3528ASYC Source: www.kingbright.com
LS_SPI = TI-TXB0108PWR:TXB0108PWR: 8-BIT BIDIRECTIONAL VOLTAGE-LEVEL TRANSLATOR; MPN: TXB0108PWR; OC_FARNELL: 1494945; OC_NEWARK: 27M1151; PACKAGE: TSSOP-20; SUPPLIER: Texas Instruments
NPN1-NPN4 = transistor-npn:BC849*: NPN Transistor
P8 P9 = pinhead-2x23:PINHD-2X23
PNP1-PNP4 = transistor-pnp:BC858*: PNP Transistror
POTI1-POTI3 SERVO1 SERVO2 = pinhead:PINHD-1X3: PIN HEADER
R1-R9 R13-R30 = rcl:R-EU_: RESISTOR, European symbol
SJ1 SJ2 = jumper:SJ: SMD solder JUMPER
SPI_EXTERN = con-ml:ML6: HARTING
STECKER_BOX = con-ml:ML10: HARTING
U1 U3 = ADUM1200:ADUM1200ARZ: Dual-Channel Digital Isolators; MPN: ADUM1200ARZ; OC_FARNELL: 1078204; OC_NEWARK: 19M0750; PACKAGE: SOIC-8; SUPPLIER: Analog Devices
U2 U4 = ADUM1300:ADUM1300ARWZ: Triple-Channel Digital Isolators; MPN: ADUM1300ARWZ; OC_FARNELL: 1226209; OC_NEWARK: 19M8751; PACKAGE: SOIC-16; SUPPLIER: Analog Devices
U$1 = Microchip-MCP2551-I_SN:MCP2551-I/SN: High-Speed CAN Transceiver; MPN: MCP2551-I/SN; OC_FARNELL: 9758569; OC_NEWARK: 69K7604; PACKAGE: SOIC-8; SUPPLIER: Microchip
U$2 U$3 = inductor_FASTRON:PISR
X1 X2 = con-ptr500:AK500/2-H: CONNECTOR Aug. 2004 / PTR Meßtechnik: Die Bezeichnung der Serie AK505 wurde geändert. Es handelt sich hierbei um AK500 in horizontaler Ausführung.